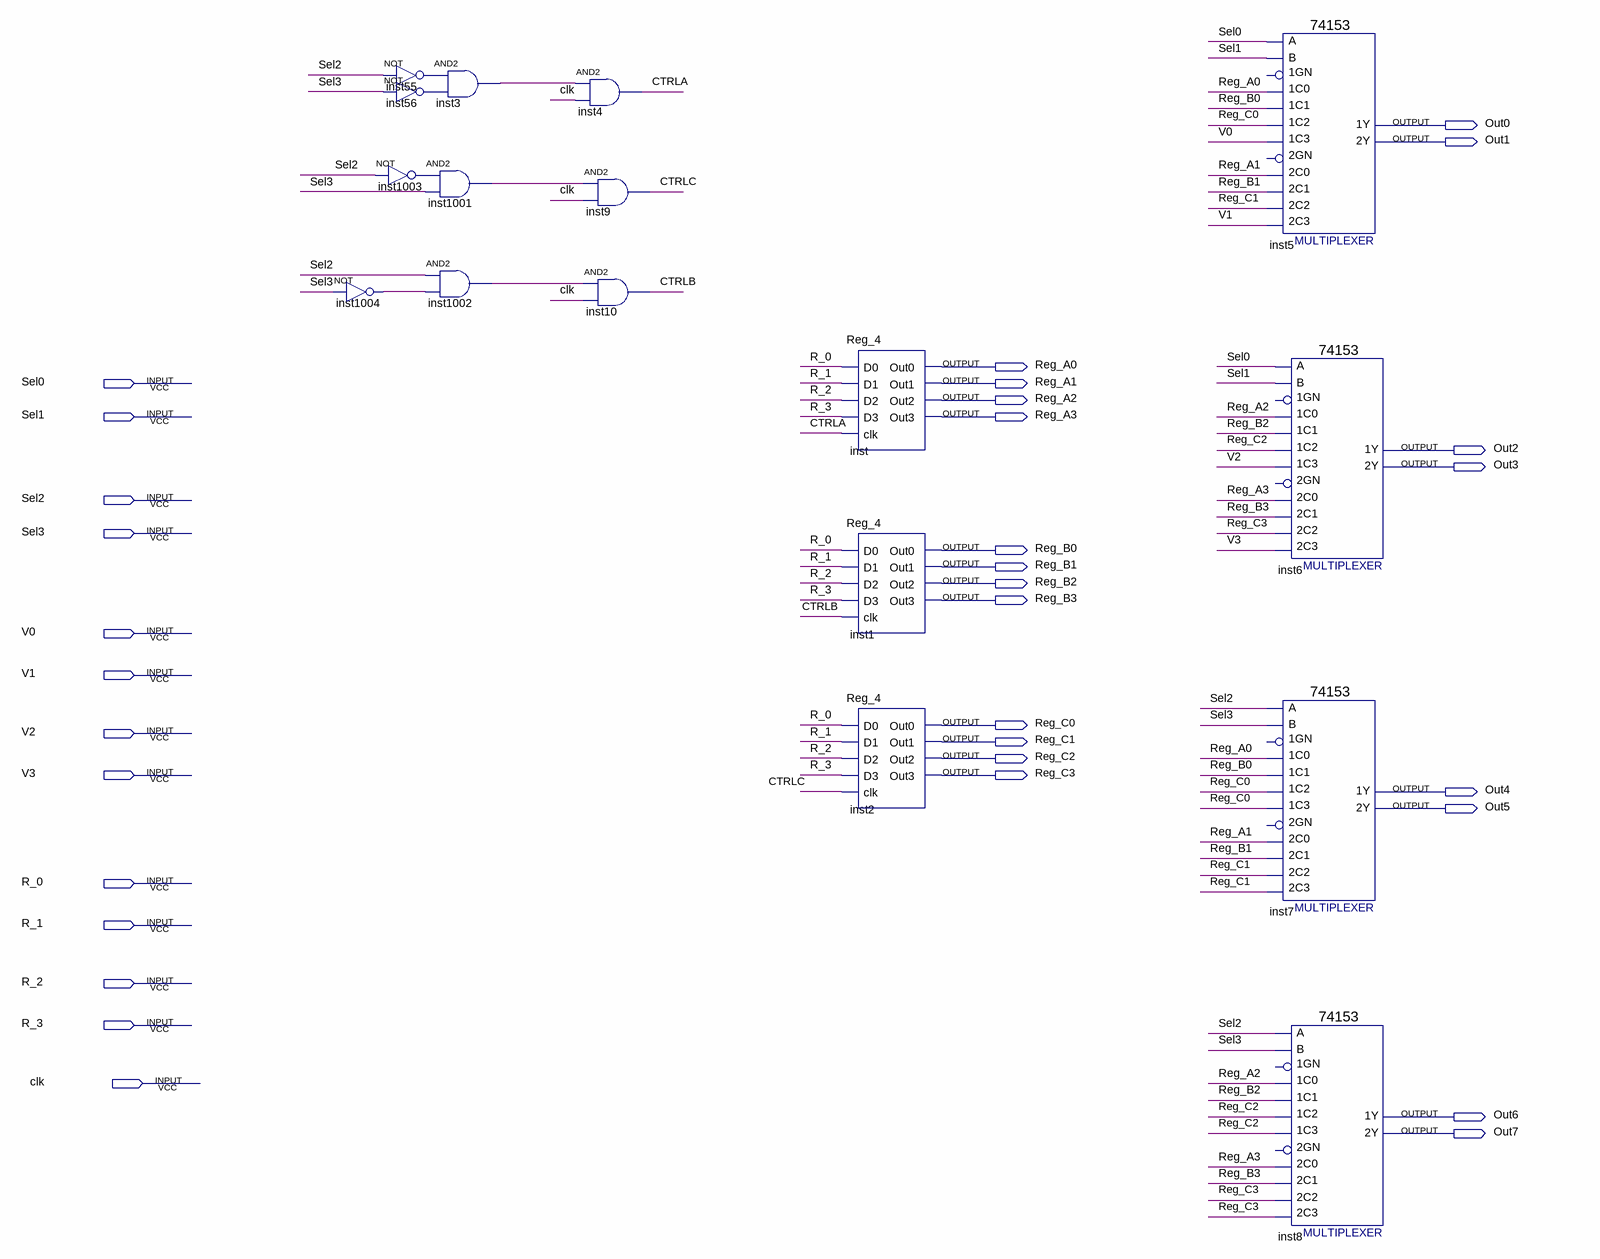
[diagram p0: schematic sheet]
// Quartus schematic Reg_File.bdf as structural Verilog: 17 symbols, 33 pins
module Reg_File (
  input  Sel0,
  input  Sel1,
  input  Sel2,
  input  Sel3,
  input  V0,
  input  V1,
  input  V2,
  input  V3,
  input  R_0,
  input  R_1,
  input  R_2,
  input  R_3,
  input  clk,
  output Out0,
  output Out1,
  output Reg_A0,
  output Reg_A1,
  output Reg_A2,
  output Reg_A3,
  output Out2,
  output Out3,
  output Reg_B0,
  output Reg_B1,
  output Reg_B2,
  output Reg_B3,
  output Reg_C0,
  output Reg_C1,
  output Reg_C2,
  output Reg_C3,
  output Out4,
  output Out5,
  output Out6,
  output Out7
);

  wire CTRLA, CTRLB, CTRLC, inst3_out, inst55_out, inst56_out, inst1001_out, inst1002_out, inst1003_out,
       inst1004_out;

  not inst55 (inst55_out, Sel2);
  not inst56 (inst56_out, Sel3);
  not inst1003 (inst1003_out, Sel2);
  not inst1004 (inst1004_out, Sel3);
  and inst3 (inst3_out, inst55_out, inst56_out);
  and inst1001 (inst1001_out, inst1003_out, Sel3);
  and inst1002 (inst1002_out, Sel2, inst1004_out);
  and inst4 (CTRLA, inst3_out, clk);
  and inst9 (CTRLC, inst1001_out, clk);
  and inst10 (CTRLB, inst1002_out, clk);
  Reg_4 inst (
    .D0(R_0), .D1(R_1), .D2(R_2), .D3(R_3), .clk(CTRLA), .Out0(Reg_A0), .Out1(Reg_A1), .Out2(Reg_A2),
    .Out3(Reg_A3));
  Reg_4 inst1 (
    .D0(R_0), .D1(R_1), .D2(R_2), .D3(R_3), .clk(CTRLB), .Out0(Reg_B0), .Out1(Reg_B1), .Out2(Reg_B2),
    .Out3(Reg_B3));
  Reg_4 inst2 (
    .D0(R_0), .D1(R_1), .D2(R_2), .D3(R_3), .clk(CTRLC), .Out0(Reg_C0), .Out1(Reg_C1), .Out2(Reg_C2),
    .Out3(Reg_C3));
  \74153  inst5 (
    .\1C1 (Reg_B0), .\1C0 (Reg_A0), .\2C0 (Reg_A1), .\2C2 (Reg_C1), .\1C2 (Reg_C0), .\1C3 (V0), .B(Sel1),
    .A(Sel0), .\2C1 (Reg_B1), .\2C3 (V1), .\1Y (Out0), .\2Y (Out1));  // open: 1GN, 2GN
  \74153  inst6 (
    .\1C1 (Reg_B2), .\1C0 (Reg_A2), .\2C0 (Reg_A3), .\2C2 (Reg_C3), .\1C2 (Reg_C2), .\1C3 (V2), .B(Sel1),
    .A(Sel0), .\2C1 (Reg_B3), .\2C3 (V3), .\1Y (Out2), .\2Y (Out3));  // open: 1GN, 2GN
  \74153  inst7 (
    .\1C1 (Reg_B0), .\1C0 (Reg_A0), .\2C0 (Reg_A1), .\2C2 (Reg_C1), .\1C2 (Reg_C0), .\1C3 (Reg_C0), .B(Sel3),
    .A(Sel2), .\2C1 (Reg_B1), .\2C3 (Reg_C1), .\1Y (Out4), .\2Y (Out5));  // open: 1GN, 2GN
  \74153  inst8 (
    .\1C1 (Reg_B2), .\1C0 (Reg_A2), .\2C0 (Reg_A3), .\2C2 (Reg_C3), .\1C2 (Reg_C2), .\1C3 (Reg_C2), .B(Sel3),
    .A(Sel2), .\2C1 (Reg_B3), .\2C3 (Reg_C3), .\1Y (Out6), .\2Y (Out7));  // open: 1GN, 2GN
endmodule
